# Altium schematic sheet STM32F103.SchDoc
size A; SheetNumber: 4; SheetTotal: 7
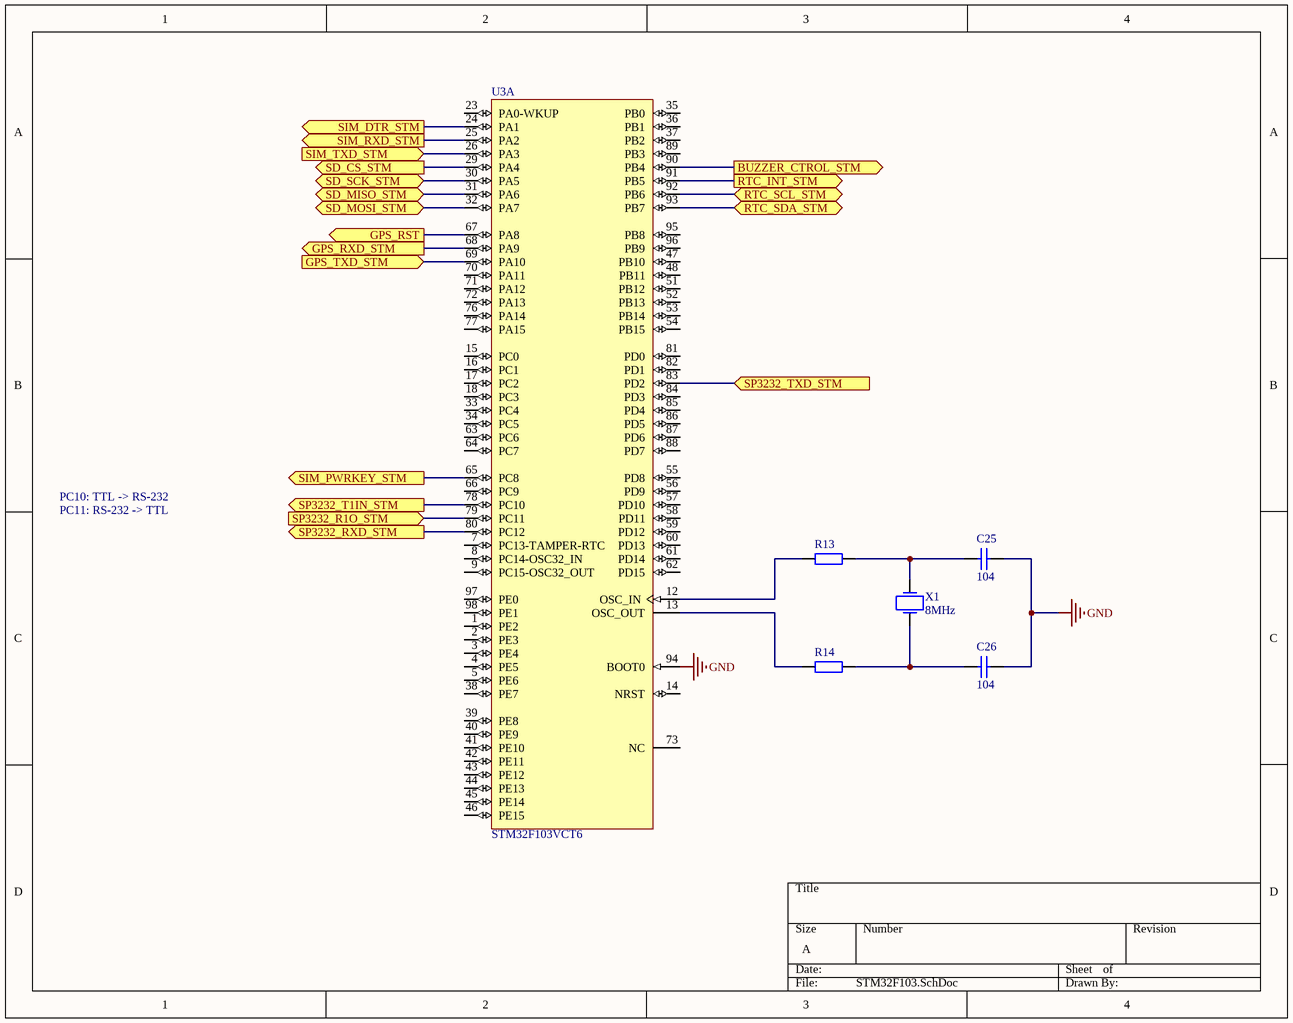
[diagram p0: STM32F103.SchDoc]

## Parts
C25  104  [0805]
C26  104  [0805]
R13  (no value)  [RES-1/4W]
R14  (no value)  [RES-1/4W]
U3  STM32F103VCT6  [STM-LQFP100_M]  (part A of 2)
X1  8MHz  [XTAL_THG_HC49/US]

## Ports
BUZZER_CTROL_STM (out), GPS_RST (out), GPS_RXD_STM (out), GPS_TXD_STM (in), RTC_INT_STM (out), RTC_SCL_STM (bidir), RTC_SDA_STM (bidir), SD_CS_STM (out), SD_MISO_STM (bidir), SD_MOSI_STM (bidir), SD_SCK_STM (bidir), SIM_DTR_STM (out), SIM_PWRKEY_STM (out), SIM_RXD_STM (out), SIM_TXD_STM (in), SP3232_R1O_STM (in), SP3232_RXD_STM (out), SP3232_T1IN_STM (out), SP3232_TXD_STM (in)

## Nets
GND: C25.2 C26.2 U3.94(BOOT0)
BUZZER_CTROL_STM: U3.90(PB4) ; port BUZZER_CTROL_STM
GPS_RST: U3.67(PA8) ; port GPS_RST
GPS_RXD_STM: U3.68(PA9) ; port GPS_RXD_STM
GPS_TXD_STM: U3.69(PA10) ; port GPS_TXD_STM
RTC_INT_STM: U3.91(PB5) ; port RTC_INT_STM
RTC_SCL_STM: U3.92(PB6) ; port RTC_SCL_STM
RTC_SDA_STM: U3.93(PB7) ; port RTC_SDA_STM
SD_CS_STM: U3.29(PA4) ; port SD_CS_STM
SD_MISO_STM: U3.31(PA6) ; port SD_MISO_STM
SD_MOSI_STM: U3.32(PA7) ; port SD_MOSI_STM
SD_SCK_STM: U3.30(PA5) ; port SD_SCK_STM
SIM_DTR_STM: U3.24(PA1) ; port SIM_DTR_STM
SIM_PWRKEY_STM: U3.65(PC8) ; port SIM_PWRKEY_STM
SIM_RXD_STM: U3.25(PA2) ; port SIM_RXD_STM
SIM_TXD_STM: U3.26(PA3) ; port SIM_TXD_STM
SP3232_R1O_STM: U3.79(PC11) ; port SP3232_R1O_STM
SP3232_RXD_STM: U3.80(PC12) ; port SP3232_RXD_STM
SP3232_T1IN_STM: U3.78(PC10) ; port SP3232_T1IN_STM
SP3232_TXD_STM: U3.83(PD2) ; port SP3232_TXD_STM
NetC25_1: C25.1 R13.1 X1.2(OSC2)
NetC26_1: C26.1 R14.1 X1.1(OSC1)
NetR13_2: R13.2 U3.12(OSC_IN)
NetR14_2: R14.2 U3.13(OSC_OUT)

Not connected (* = marked no-connect by the designer): U3 1(PE2) 2(PE3) 3(PE4) 4(PE5) 5(PE6) 7(PC13-TAMPER-RTC) 8(PC14-OSC32_IN) 9(PC15-OSC32_OUT) 14(NRST) 15(PC0) 16(PC1) 17(PC2) 18(PC3) 23(PA0-WKUP) 33(PC4) 34(PC5) 35(PB0) 36(PB1) 37(PB2) 38(PE7) 39(PE8) 40(PE9) 41(PE10) 42(PE11) 43(PE12) 44(PE13) 45(PE14) 46(PE15) 47(PB10) 48(PB11) 51(PB12) 52(PB13) 53(PB14) 54(PB15) 55(PD8) 56(PD9) 57(PD10) 58(PD11) 59(PD12) 60(PD13) 61(PD14) 62(PD15) 63(PC6) 64(PC7) 66(PC9) 70(PA11) 71(PA12) 72(PA13) 73(NC) 76(PA14) 77(PA15) 81(PD0) 82(PD1) 84(PD3) 85(PD4) 86(PD5) 87(PD6) 88(PD7) 89(PB3) 95(PB8) 96(PB9) 97(PE0) 98(PE1)

## Notes on the sheet
- PC10: TTL -> RS-232
- PC11: RS-232 -> TTL

## Library data of the parts
C25 C26 = Cap 104_SMD: Capacitor (Semiconductor SIM Model); Value: 0.1uF; Published: 8-Jun-2000; LatestRevisionDate: 17-Jul-2002; LatestRevisionNote: Re-released for DXP Platform.; PackageReference: C1206; Publisher: Altium Limited
R13 R14 = R: Resistor R1/4W
U3 = STM32F103VCT6: ARM Cortex-M3 32-bit MCU, 256 KB Flash, 48 KB Internal RAM, 80 I/Os, 100-pin LQFP, -40 to 85 degC, Tray; A/D Converter: 3x12-bit (16 Channel); D/A Converter: 2x12-bit (2 Channel); FLASH Size (Prog) (kB): 256; I/Os (High Current): 80; Internal RAM Size (kB): 48; Operating Frequency(F) (Processor speed) (MHz): 72; Supply Voltage(Vcc) min (V): 2; DatasheetVersion: Rev. 8; PackageVersion: Rev. 1, 06/2013; PackageReference: LQFP100; PackageDescription: 100-Pin Low Profile Quad Flat Package, 14 x 14 mm Body, 0.5 mm Pitch; Supplier 1: Digi-Key; Supplier Part Number 1: 497-9034-ND; Supplier 2: Farnell; Supplier Part Number 2: 1624139; Supplier 3: Newark; Supplier Part Number 3: 57P1255; Supplier 4: Mouser; Supplier Part Number 4: 511-STM32F103VCT6; Core: ARM Cortex-M3; Packing: Tray; Mounting Technology: Surface Mount; PartNumber: STM32F103VCT6; ComponentLink1Description: Manufacturer URL; ComponentLink1URL: http://www.st.com/web/en/home.html; ComponentLink2Description: Datasheet; ComponentLink2URL: http://www.st.com/st-web-ui/static/active/en/resource/technical/document/datasheet/CD00191185.pdf; ComponentLink3Description: Package Specification; ComponentLink3URL: http://www.st.com/st-web-ui/static/active/en/resource/technical/document/data_brief/DM00071938.pdf
X1 = XTAL_9B-8.000MAAE-B: CRYSTAL 8.0000MHZ 12PF T/H; Manufacturer: TXC CORPORATION; Frequency Stability: ±30ppm; Operating Mode: Fundamental; Supplier 1: Digi-Key; Manufacturer Part Number: 9B-8.000MAAE-B; RoHS: RoHS Compliant; Category: Crystals, Oscillators, Resonators; Stock 1: 0; Pricing 1: 1000=0.192 (USD); Packaging: Bulk; Part Status: Active; Type: MHz Crystal; Frequency Tolerance: ±30ppm; Load Capacitance: 12pF; Operating Temperature: -20°C ~ 70°C; Ratings: -; Mounting Type: Through Hole; Package / Case: HC49/US; Size / Dimension: 0.453" L x 0.197" W (11.50mm x 5.00mm); Height - Seated (Max): 0.145" (3.68mm); ComponentLink1URL: http://www.txccorp.com/download/products/quartz_crystals/2015TXC_9B_33.pdf; ComponentLink1Description: http://www.txccorp.com/download/products/quartz_crystals/2015TXC_9B_33.pdf; Supplier Part Number 1: 9B-8.000MAAE-B-ND